# Altium schematic sheet tie-il12-il68-top.SchDoc: Copper Suicide - Net Tie 12:68:T
size Letter; CheckedBy: E. Chiu; CompanyName: Signal Laboratories, Inc.; DrawnBy: J. Brinton; Engineer: J. Brinton; Address1: 3479 Edison Way; Address2: Menlo Park CA 94025; Address3: +1 (877) 778-8435; Address4: siglabs.com; Revision: 1; SheetNumber: 26; SheetTotal: 47
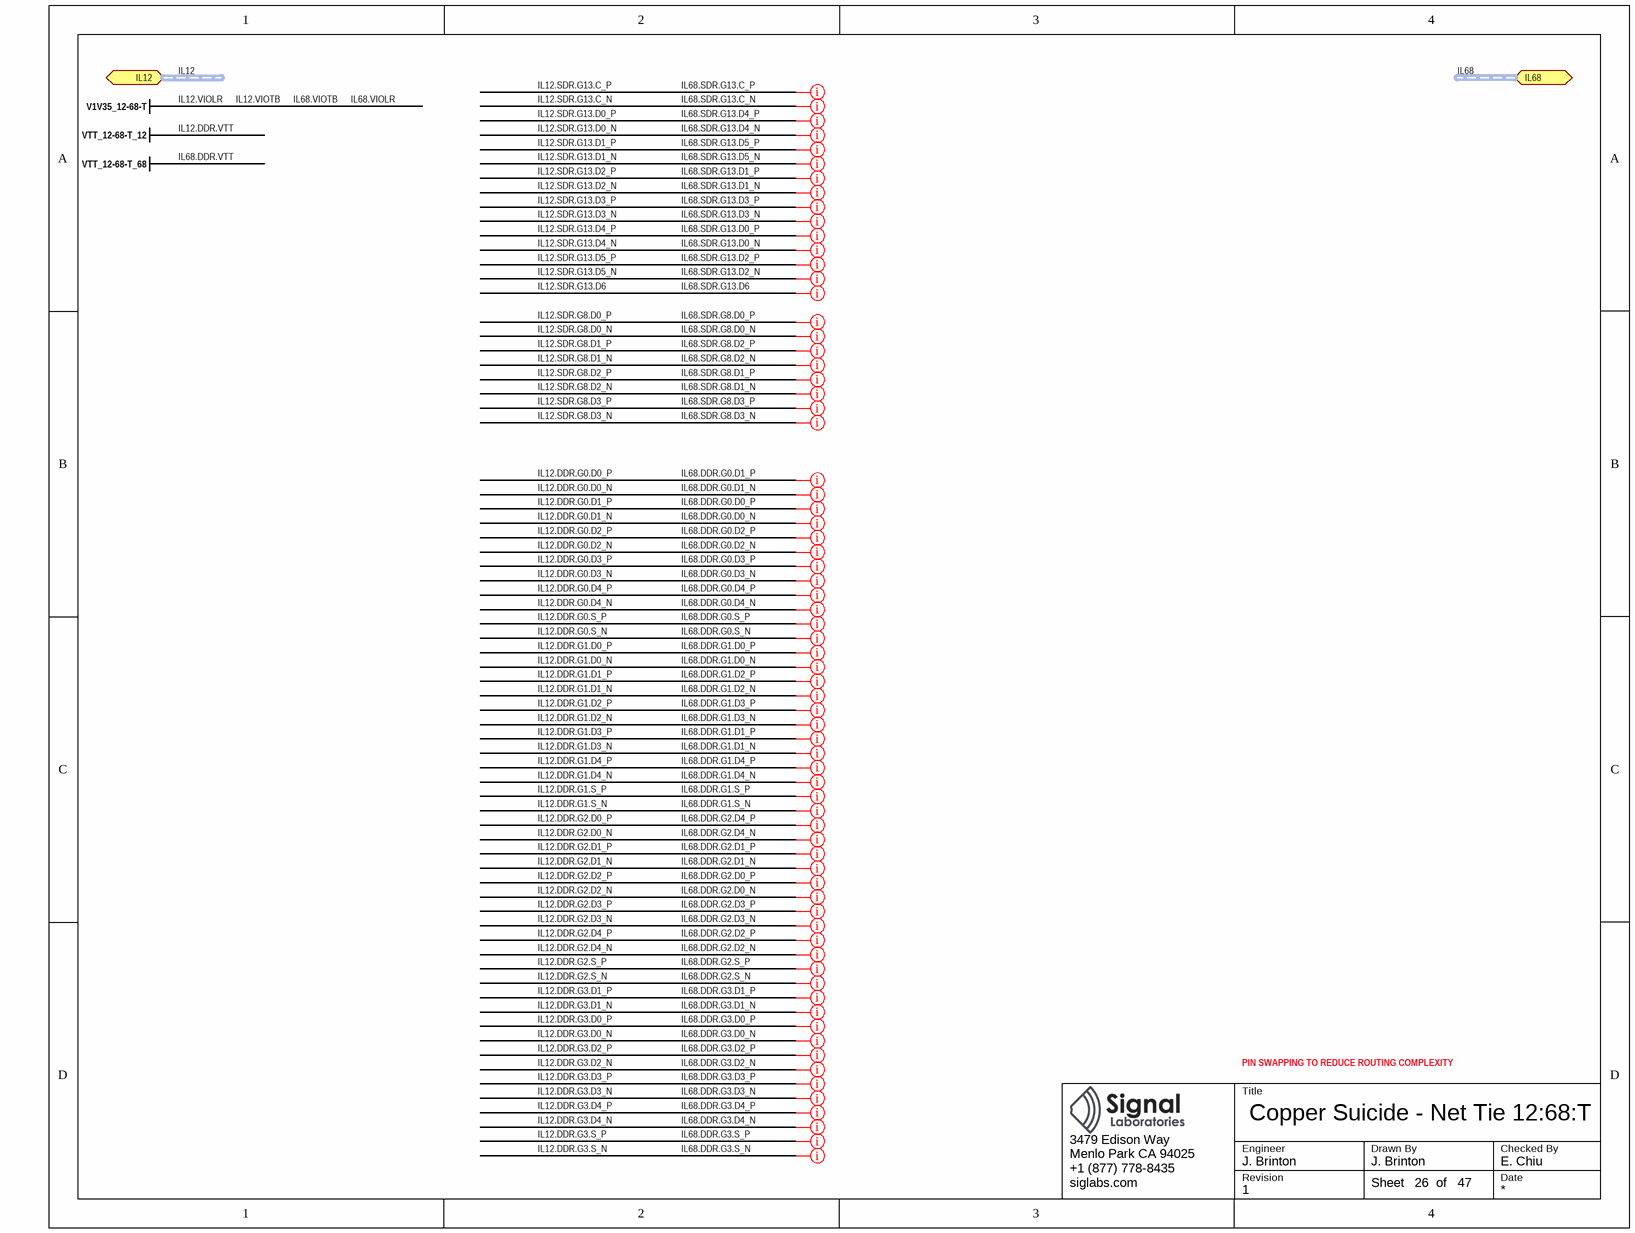
[diagram p0: tie-il12-il68-top.SchDoc]

## Ports
IL12 (harness IL-1V35), IL68 (harness IL-1V35)

## Buses and harness runs
harness IL12 = port IL12
harness IL68 = port IL68

## Layout directives
net class z50: IL12.SDR.G13.D6
net class z50; differential pair; net class loose: IL12.DDR.G0.D0_N, IL12.DDR.G0.D0_P, IL12.DDR.G0.D1_N, IL12.DDR.G0.D1_P, IL12.DDR.G0.D2_N, IL12.DDR.G0.D2_P, IL12.DDR.G0.D3_N, IL12.DDR.G0.D3_P, IL12.DDR.G0.D4_N, IL12.DDR.G0.D4_P, IL12.DDR.G0.S_N, IL12.DDR.G0.S_P, IL12.DDR.G1.D0_N, IL12.DDR.G1.D0_P, IL12.DDR.G1.D1_N, IL12.DDR.G1.D1_P, IL12.DDR.G1.D2_N, IL12.DDR.G1.D2_P, IL12.DDR.G1.D3_N, IL12.DDR.G1.D3_P, IL12.DDR.G1.D4_N, IL12.DDR.G1.D4_P, IL12.DDR.G1.S_N, IL12.DDR.G1.S_P, IL12.DDR.G2.D0_N, IL12.DDR.G2.D0_P, IL12.DDR.G2.D1_N, IL12.DDR.G2.D1_P, IL12.DDR.G2.D2_N, IL12.DDR.G2.D2_P, IL12.DDR.G2.D3_N, IL12.DDR.G2.D3_P, IL12.DDR.G2.D4_N, IL12.DDR.G2.D4_P, IL12.DDR.G2.S_N, IL12.DDR.G2.S_P, IL12.DDR.G3.D0_N, IL12.DDR.G3.D0_P, IL12.DDR.G3.D1_N, IL12.DDR.G3.D1_P, IL12.DDR.G3.D2_N, IL12.DDR.G3.D2_P, IL12.DDR.G3.D3_N, IL12.DDR.G3.D3_P, IL12.DDR.G3.D4_N, IL12.DDR.G3.D4_P, IL12.DDR.G3.S_N, IL12.DDR.G3.S_P, IL12.SDR.G8.D0_N, IL12.SDR.G8.D0_P, IL12.SDR.G8.D1_N, IL12.SDR.G8.D1_P, IL12.SDR.G8.D2_N, IL12.SDR.G8.D2_P, IL12.SDR.G8.D3_N, IL12.SDR.G8.D3_P, IL12.SDR.G13.C_N, IL12.SDR.G13.C_P, IL12.SDR.G13.D0_N, IL12.SDR.G13.D0_P, IL12.SDR.G13.D1_N, IL12.SDR.G13.D1_P, IL12.SDR.G13.D2_N, IL12.SDR.G13.D2_P, IL12.SDR.G13.D3_N, IL12.SDR.G13.D3_P, IL12.SDR.G13.D4_N, IL12.SDR.G13.D4_P, IL12.SDR.G13.D5_N, IL12.SDR.G13.D5_P

## Notes on the sheet
- PIN SWAPPING TO REDUCE ROUTING COMPLEXITY
- Title
- Engineer
- Revision
- Drawn By
- Checked By
- Date
- Sheet
- of